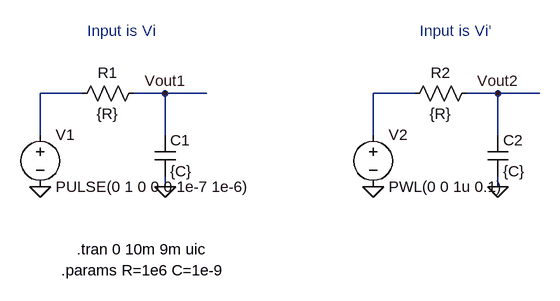
[diagram p0: schematic tut7ques4.asc]
tut7ques4.asc, the LTspice schematic file:
Version 4
SHEET 1 880 680
WIRE 64 64 0 64
WIRE 192 64 144 64
WIRE 256 64 192 64
WIRE 576 64 512 64
WIRE 704 64 656 64
WIRE 768 64 704 64
WIRE 0 128 0 64
WIRE 192 128 192 64
WIRE 512 128 512 64
WIRE 704 128 704 64
WIRE 192 208 192 192
WIRE 704 208 704 192
FLAG 0 208 0
FLAG 192 208 0
FLAG 512 208 0
FLAG 704 208 0
FLAG 192 64 Vout1
FLAG 704 64 Vout2
SYMBOL voltage 0 112 R0
WINDOW 123 0 0 Left 0
WINDOW 39 0 0 Left 0
SYMATTR InstName V1
SYMATTR Value PULSE(0 1 0 0 0 1e-7 1e-6)
SYMBOL res 160 48 R90
WINDOW 0 0 56 VBottom 2
WINDOW 3 32 56 VTop 2
SYMATTR InstName R1
SYMATTR Value {R}
SYMBOL cap 176 128 R0
SYMATTR InstName C1
SYMATTR Value {C}
SYMBOL voltage 512 112 R0
WINDOW 123 0 0 Left 0
WINDOW 39 0 0 Left 0
SYMATTR InstName V2
SYMATTR Value PWL(0 0 1u 0.1)
SYMBOL res 672 48 R90
WINDOW 0 0 56 VBottom 2
WINDOW 3 32 56 VTop 2
SYMATTR InstName R2
SYMATTR Value {R}
SYMBOL cap 688 128 R0
SYMATTR InstName C2
SYMATTR Value {C}
TEXT 56 304 Left 2 !.tran 0 10m 9m uic
TEXT 32 336 Left 2 !.params R=1e6 C=1e-9
TEXT 72 -32 Left 2 ;Input is Vi
TEXT 584 -32 Left 2 ;Input is Vi'

The netlist it stands for:
* tut7ques4.asc
V1 N001 0 PULSE(0 1 0 0 0 1e-7 1e-6)
R1 Vout1 N001 {R}
C1 Vout1 0 {C}
V2 N002 0 PWL(0 0 1u 0.1)
R2 Vout2 N002 {R}
C2 Vout2 0 {C}
.tran 0 10m 9m uic
.params R=1e6 C=1e-9
* Input is Vi
* Input is Vi'
.backanno
.end